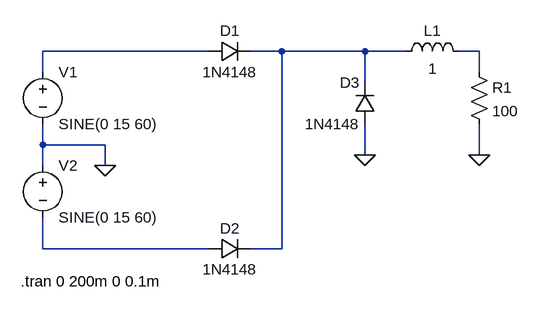
[diagram p0: schematic retificador_trafo_terminação_central_RL e diodo.asc]
retificador_trafo_terminação_central_RL e diodo.asc, the LTspice schematic file:
Version 4
SHEET 1 880 680
WIRE 240 -64 -16 -64
WIRE 352 -64 304 -64
WIRE 480 -64 352 -64
WIRE 544 -64 480 -64
WIRE 656 -64 624 -64
WIRE -16 -32 -16 -64
WIRE 656 -32 656 -64
WIRE 480 -16 480 -64
WIRE -16 80 -16 48
WIRE 80 80 -16 80
WIRE 480 96 480 48
WIRE 656 96 656 48
WIRE -16 112 -16 80
WIRE 80 112 80 80
WIRE -16 240 -16 192
WIRE 240 240 -16 240
WIRE 352 240 352 -64
WIRE 352 240 304 240
FLAG 80 112 0
FLAG 656 96 0
FLAG 480 96 0
SYMBOL diode 240 -48 R270
WINDOW 0 32 32 VTop 2
WINDOW 3 0 32 VBottom 2
SYMATTR InstName D1
SYMATTR Value 1N4148
SYMBOL diode 240 256 R270
WINDOW 0 32 32 VTop 2
WINDOW 3 0 32 VBottom 2
SYMATTR InstName D2
SYMATTR Value 1N4148
SYMBOL voltage -16 -48 R0
WINDOW 123 0 0 Left 0
WINDOW 39 0 0 Left 0
SYMATTR InstName V1
SYMATTR Value SINE(0 15 60)
SYMBOL voltage -16 96 R0
WINDOW 123 0 0 Left 0
WINDOW 39 0 0 Left 0
SYMATTR InstName V2
SYMATTR Value SINE(0 15 60)
SYMBOL res 640 -48 R0
SYMATTR InstName R1
SYMATTR Value 100
SYMBOL ind 528 -48 R270
WINDOW 0 32 56 VTop 2
WINDOW 3 5 56 VBottom 2
SYMATTR InstName L1
SYMATTR Value 1
SYMBOL diode 496 48 R180
WINDOW 0 24 64 Left 2
WINDOW 3 24 0 Left 2
SYMATTR InstName D3
SYMATTR Value 1N4148
TEXT -50 290 Left 2 !.tran 0 200m 0 0.1m

The netlist it stands for:
* retificador_trafo_terminação_central_RL e diodo.asc
D1 N001 N002 1N4148
D2 N004 N002 1N4148
V1 N001 0 SINE(0 15 60)
V2 0 N004 SINE(0 15 60)
R1 N003 0 100
L1 N002 N003 1
D3 0 N002 1N4148
.model D D
.lib standard.dio
.tran 0 200m 0 0.1m
.backanno
.end